# EAGLE design ControllerRC2 (EAGLE 9.2.2)
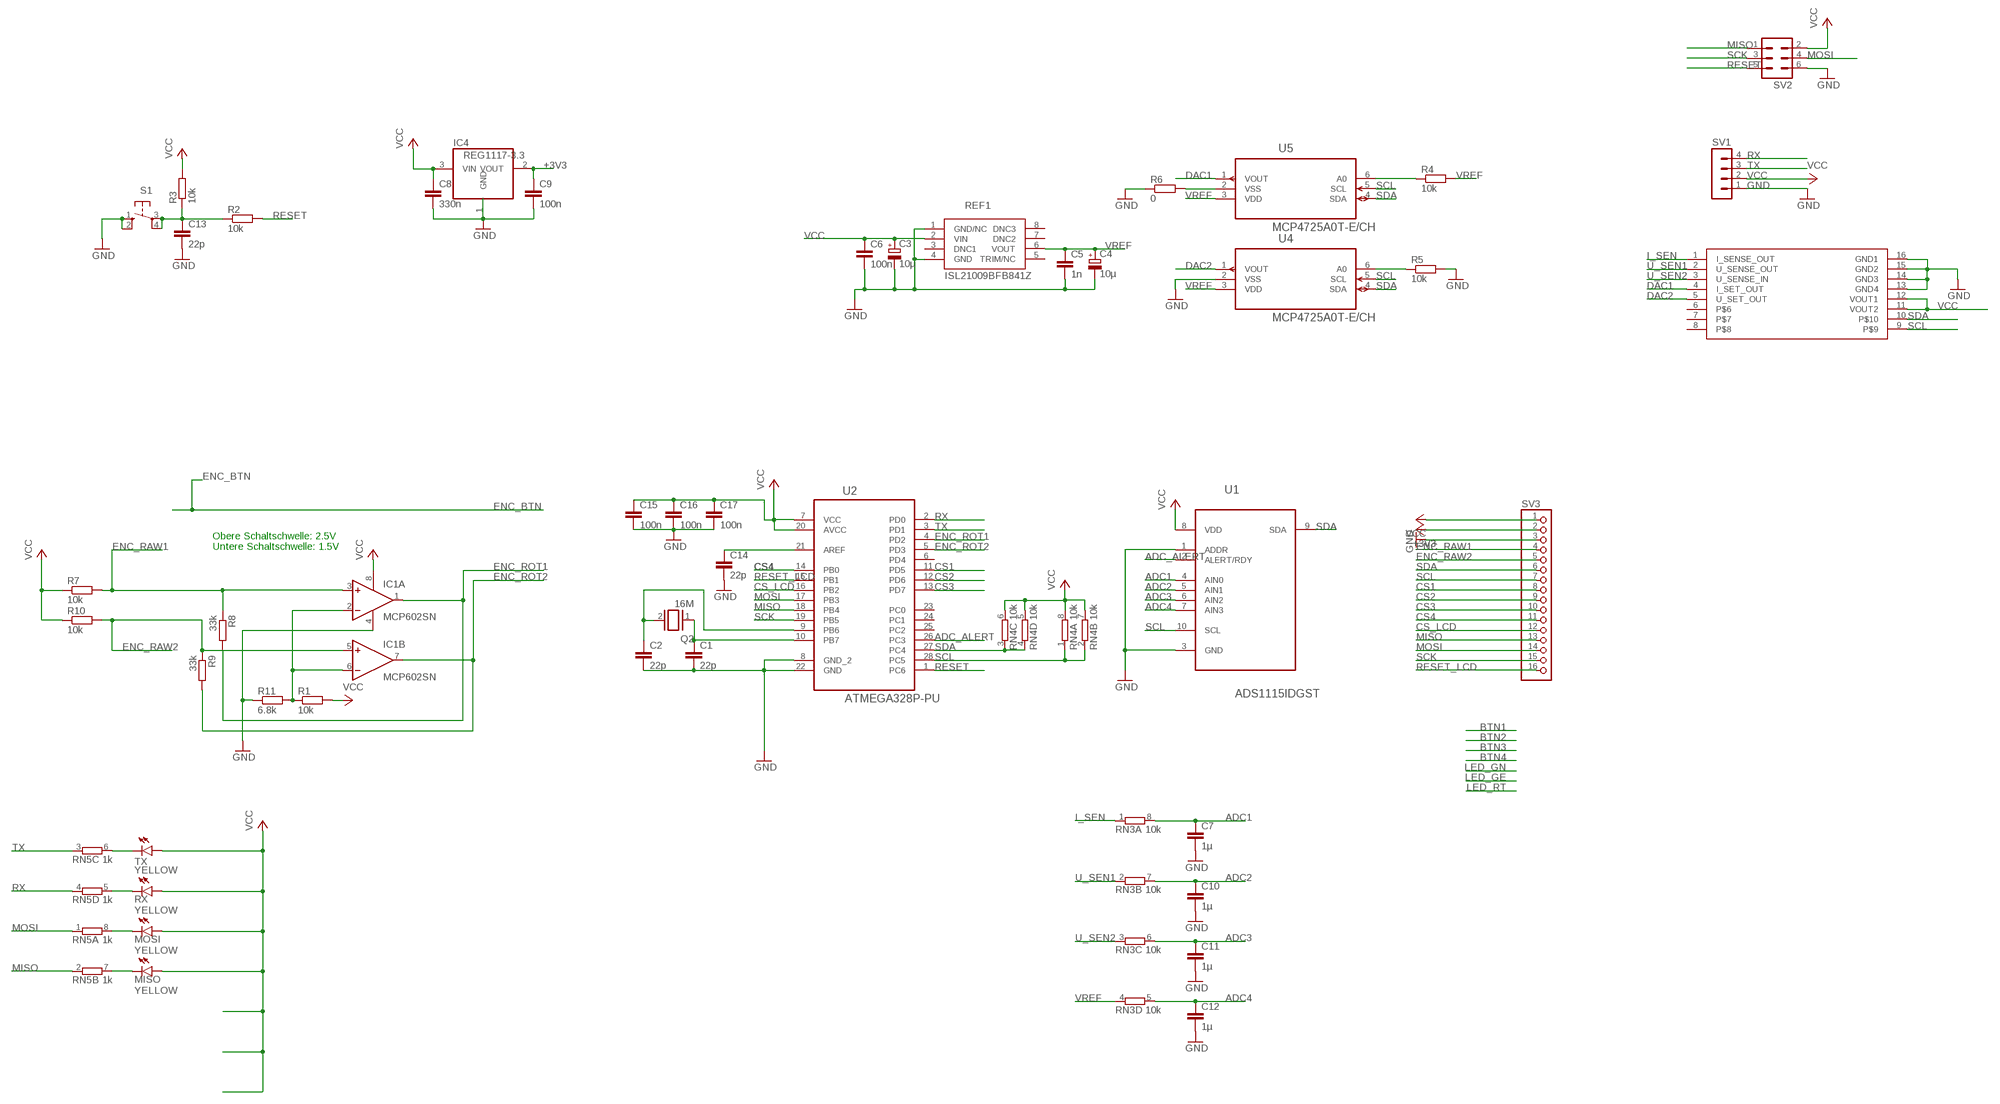
[diagram p0: schematic, sheet 1]

## Parts
C1  22p  C-EUC0603  [C0603]
C2  22p  C-EUC0603  [C0603]
C3  10µ  CPOL-EUE2,5-6E  [E2,5-6E]
C4  10µ  CPOL-EUE2,5-6E  [E2,5-6E]
C5  1n  C-EUC0603  [C0603]
C6  100n  C-EUC0603  [C0603]
C7  1µ  C-EUC0603  [C0603]
C8  330n  C-EUC0603  [C0603]
C9  100n  C-EUC0603  [C0603]
C10  1µ  C-EUC0603  [C0603]
C11  1µ  C-EUC0603  [C0603]
C12  1µ  C-EUC0603  [C0603]
C13  22p  C-EUC0603  [C0603]
C14  22p  C-EUC0603  [C0603]
C15  100n  C-EUC0603  [C0603]
C16  100n  C-EUC0603  [C0603]
C17  100n  C-EUC0603  [C0603]
IC1  MCP602SN  [SO08]
IC4  REG1117-3.3  REG1117  [SOT223]
MISO  YELLOW  LEDCHIP-LED0805  [CHIP-LED0805]
MOSI  YELLOW  LEDCHIP-LED0805  [CHIP-LED0805]
Q2  16M  XTAL/S  [QS]
R1  10k  R-EU_R0603  [R0603]
R2  10k  R-EU_R0603  [R0603]
R3  10k  R-EU_R0603  [R0603]
R4  10k  R-EU_R0603  [R0603]
R5  10k  R-EU_R0603  [R0603]
R6  0  R-EU_R0603  [R0603]
R7  10k  R-EU_R0603  [R0603]
R8  33k  R-EU_R0603  [R0603]
R9  33k  R-EU_R0603  [R0603]
R10  10k  R-EU_R0603  [R0603]
R11  6.8k  R-EU_R0603  [R0603]
REF1  ISL21009BFB841Z  [SOIC127P600X175-8N]
RN3  10k  4R-N0603-ARC  [0603-ARC]
RN4  10k  4R-N0603-ARC  [0603-ARC]
RN5  1k  4R-N0603-ARC  [0603-ARC]
RX  YELLOW  LEDCHIP-LED0805  [CHIP-LED0805]
S1  10-XX  [B3F-10XX]
SV1  MA04-1  [MA04-1]
SV2  MA03-2  [MA03-2]
SV3  PINHD-1X16  [1X16]
TX  YELLOW  LEDCHIP-LED0805  [CHIP-LED0805]
U1  ADS1115IDGST  [SOP50P490X110-10N]
U2  ATMEGA328P-PU  [DIP254P762X457-28]
U4  MCP4725A0T-E/CH  [SOT95P270X145-6N]
U5  MCP4725A0T-E/CH  [SOT95P270X145-6N]
U$1  DCPINHEADER  [CDIP16]

## Nets
+3V3: C9.1 IC4.2(VOUT) SV3.2
ADC1: C7.1 RN3.8 U1.4(AIN0)
ADC2: C10.1 RN3.7 U1.5(AIN1)
ADC3: C11.1 RN3.6 U1.6(AIN2)
ADC4: C12.1 RN3.5 U1.7(AIN3)
ADC_ALERT: U1.2(ALERT/RDY) U2.26(PC3)
CS1: SV3.8 U2.11(PD5)
CS2: SV3.9 U2.12(PD6)
CS3: SV3.10 U2.13(PD7)
CS4: SV3.11 U2.14(PB0)
CS_LCD: SV3.12 U2.16(PB2)
DAC1: U5.1(VOUT) U$1.4(I_SET_OUT)
DAC2: U4.1(VOUT) U$1.5(U_SET_OUT)
ENC_RAW1: IC1.3(A:+IN) R7.2 R8.1 SV3.4
ENC_RAW2: IC1.5(B:+IN) R9.1 R10.2 SV3.5
ENC_ROT1: IC1.1(A:OUT) R8.2 U2.4(PD2)
ENC_ROT2: IC1.7(B:OUT) R9.2 U2.5(PD3)
GND: C1.2 C2.2 C3.- C4.- C5.2 C6.2 C7.2 C8.2 C9.2 C10.2 C11.2 C12.2 C13.2 C14.2 C15.2 C16.2 C17.2 IC1.4(P:V-) IC4.1(GND) R5.2 R6.1 R11.1 REF1.1(GND/NC) REF1.4(GND) S1.1(S) S1.2(S1) SV1.1 SV2.6 SV3.3 U1.1(ADDR) U1.3(GND) U2.8(GND_2) U2.22(GND) U4.2(VSS) U$1.13(GND4) U$1.14(GND3) U$1.15(GND2) U$1.16(GND1)
I_SEN: RN3.1 U$1.1(I_SENSE_OUT)
MISO: RN5.2 SV2.1 SV3.13 U2.18(PB4)
MOSI: RN5.1 SV2.4 SV3.14 U2.17(PB3)
N$1: C1.1 Q2.1 U2.10(PB7)
N$2: RN5.6 TX.C
N$3: RN5.5 RX.C
N$4: MOSI.C RN5.8
N$5: MISO.C RN5.7
N$6: C2.1 Q2.2 U2.9(PB6)
N$7: C14.1 U2.21(AREF)
N$8: R4.1 U5.6(A0)
N$11: R5.1 U4.6(A0)
N$12: R6.2 U5.2(VSS)
N$13: IC1.2(A:-IN) IC1.6(B:-IN) R1.1 R11.2
N$14: C13.1 R2.1 R3.1 S1.3(P) S1.4(P1)
RESET: R2.2 SV2.5 U2.1(PC6)
RESET_LCD: SV3.16 U2.15(PB1)
RX: RN5.4 SV1.4 U2.2(PD0)
SCK: SV2.3 SV3.15 U2.19(PB5)
SCL: RN4.1 RN4.2 SV3.7 U1.10(SCL) U2.28(PC5) U4.5(SCL) U5.5(SCL) U$1.9
SDA: RN4.3 RN4.4 SV3.6 U1.9(SDA) U2.27(PC4) U4.4(SDA) U5.4(SDA) U$1.10
TX: RN5.3 SV1.3 U2.3(PD1)
U_SEN1: RN3.2 U$1.2(U_SENSE_OUT)
U_SEN2: RN3.3 U$1.3(U_SENSE_IN)
VCC: C3.+ C6.1 C8.1 C15.1 C16.1 C17.1 IC1.8(P:V+) IC4.3(VIN) MISO.A MOSI.A R1.2 R3.2 R7.1 R10.1 REF1.2(VIN) RN4.5 RN4.6 RN4.7 RN4.8 RX.A SV1.2 SV2.2 SV3.1 TX.A U1.8(VDD) U2.7(VCC) U2.20(AVCC) U$1.11(VOUT2) U$1.12(VOUT1)
VREF: C4.+ C5.1 R4.2 REF1.6(VOUT) RN3.4 U4.3(VDD) U5.3(VDD)
Unconnected: REF1.3(DNC1) REF1.5(TRIM/NC) REF1.7(DNC2) REF1.8(DNC3) U2.6(PD4) U2.23(PC0) U2.24(PC1) U2.25(PC2) U$1.6 U$1.7 U$1.8

## Notes on the sheet
- Obere Schaltschwelle: 2.5V
  Untere Schaltschwelle: 1.5V

## Library data of the parts
C1 C2 C5-C17 = rcl:C-EU: CAPACITOR, European symbol; SPICEPREFIX: C
C3 C4 = rcl:CPOL-EU: POLARIZED CAPACITOR, European symbol; SPICEPREFIX: C
IC1 = linear:MCP602: Single Op Amp 2.7V to 6.0V Single Supply CMOS Source: http://ww1.microchip.com/downloads/en/DeviceDoc/21314g.pdf
IC4 = burr-brown:REG1117: 800mA and 1A Low Dropout (LDO) Positive Regulator 1.8V, 2.5V, 2.85V, 3.3V, 5V, and Adj; MPN: REG1117; OC_FARNELL: 1097566; OC_NEWARK: 14P6981
MISO MOSI RX TX = led:LED: LED OSRAM: - CHIPLED LG R971, LG N971, LY N971, LG Q971, LY Q971, LO R971, LY R971 LH N974, LH R974 LS Q976, LO Q976, LY Q976 LO Q996 - Hyper CHIPLED LW Q18S LB Q993, LB Q99A, LB R99A - SideLED LS A670, LO A670, LY A670, LG A670, LP A670 LB A673, LV A673, LT A673, LW A673 LH A674 LY A675 LS A676, LA A676, LO A676, LY A676, LW A676 LS A679, LY A679, LG A679 - Hyper Micro SIDELED® LS Y876, LA Y876, LO Y876, LY Y876 LT Y87S - SmartLED LW L88C, LW L88S LB L89C, LB L89S, LG L890 LS L89K, LO L89K, LY L89K LS L896, LA L896, LO L896, LY L896 - TOPLED LS T670, LO T670, LY T670, LG T670, LP T670 LSG T670, LSP T670, LSY T670, LOP T670, LYG T670 LG T671, LOG T671, LSG T671 LB T673, LV T673, LT T673, LW T673 LH T674 LS T676, LA T676, LO T676, LY T676, LB T676, LH T676, LSB T676, LW T676 LB T67C, LV T67C, LT T67C, LS T67K, LO T67K, LY T67K, LW E67C LS E67B, LA E67B, LO E67B, LY E67B, LB E67C, LV E67C, LT E67C LW T67C LS T679, LY T679, LG T679 LS T770, LO T770, LY T770, LG T770, LP T770 LB T773, LV T773, LT T773, LW T773 LH T774 LS E675, LA E675, LY E675, LS T675 LS T776, LA T776, LO T776, LY T776, LB T776 LHGB T686 LT T68C, LB T68C - Hyper Mini TOPLED® LB M676 - Mini TOPLED Santana® LG M470 LS M47K, LO M47K, LY M47K Source: http://www.osram.convergy.de LUXEON: - LUMILED® LXK2-PW12-R00, LXK2-PW12-S00, LXK2-PW14-U00, LXK2-PW14-V00 LXK2-PM12-R00, LXK2-PM12-S00, LXK2-PM14-U00 LXK2-PE12-Q00, LXK2-PE12-R00, LXK2-PE12-S00, LXK2-PE14-T00, LXK2-PE14-U00 LXK2-PB12-K00, LXK2-PB12-L00, LXK2-PB12-M00, LXK2-PB14-N00, LXK2-PB14-P00, LXK2-PB14-Q00 LXK2-PR12-L00, LXK2-PR12-M00, LXK2-PR14-Q00, LXK2-PR14-R00 LXK2-PD12-Q00, LXK2-PD12-R00, LXK2-PD12-S00 LXK2-PH12-R00, LXK2-PH12-S00 LXK2-PL12-P00, LXK2-PL12-Q00, LXK2-PL12-R00 Source: www.luxeon.com KINGBRIGHT: KA-3528ASYC Source: www.kingbright.com
Q2 = special:XTAL/S: CRYSTAL
R1-R11 = rcl:R-EU_: RESISTOR, European symbol; SPICEPREFIX: R
REF1 = custom:ISL21009BFB841Z
RN3-RN5 = resistor-dil:4R-N: Array Chip Resistor Source: RS Component / Phycomp; OC_FARNELL: unknown; OC_NEWARK: unknown
S1 = switch-omron:10-XX: OMRON SWITCH; MPN: B3F-1000; OC_FARNELL: 176432; OC_NEWARK: 36M3542
SV1 = con-lstb:MA04-1: PIN HEADER; OC_FARNELL: unknown; OC_NEWARK: unknown
SV2 = con-lstb:MA03-2: PIN HEADER; OC_FARNELL: unknown; OC_NEWARK: unknown
SV3 = pinhead:PINHD-1X16: PIN HEADER
U1 = Texas Instruments_By_element14_Batch_1:ADS1115IDGST: Analog-to-Digital Converter with Internal Reference; MPN: ADS1115IDGST; OC_FARNELL: 1762981; OC_NEWARK: 25R1241; PACKAGE: MSOP-10; SUPPLIER: Texas Instruments
U2 = Atmel_By_element14_Batch_1-00:ATMEGA328P-PU: 8-bit Microcontroller with In-System Programmable Flash; MPN: ATMEGA328P-PU; OC_FARNELL: 1715487; OC_NEWARK: 15R0268; PACKAGE: PDIP-28; SUPPLIER: Atmel
U4 U5 = Microchip_By_element14_Batch_1:MCP4725A0T-E/CH: 12-Bit Digital-to-Analog Converter with EEPROM; MPN: MCP4725A0T-E/CH; OC_FARNELL: 1578449; OC_NEWARK: 77M3032; PACKAGE: SOT-23-6; SUPPLIER: Microchip
U$1 = custom:DCPINHEADER

## Board
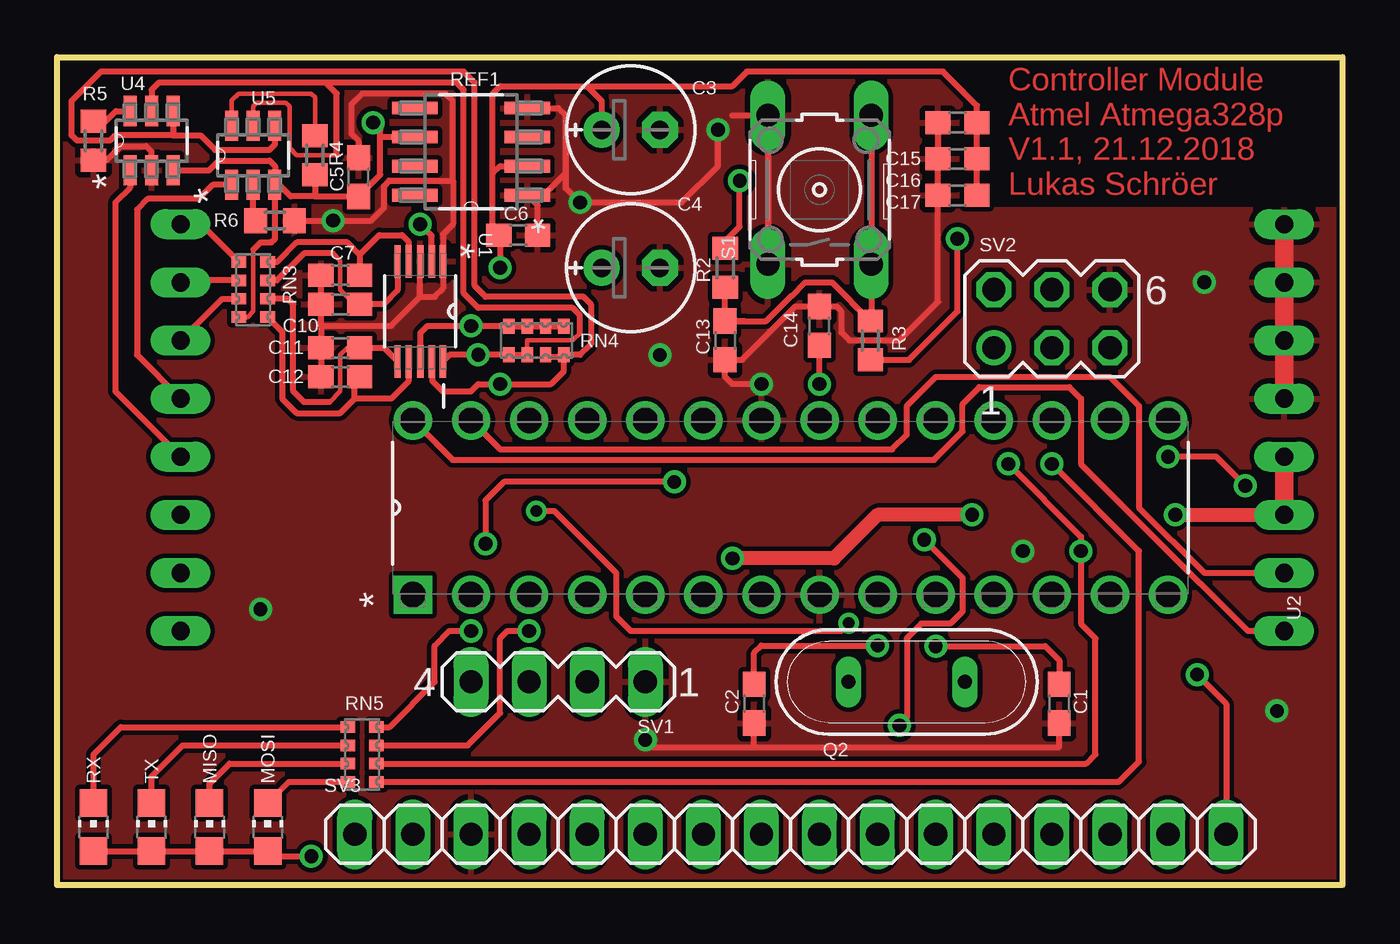
[diagram p1: board, top side]
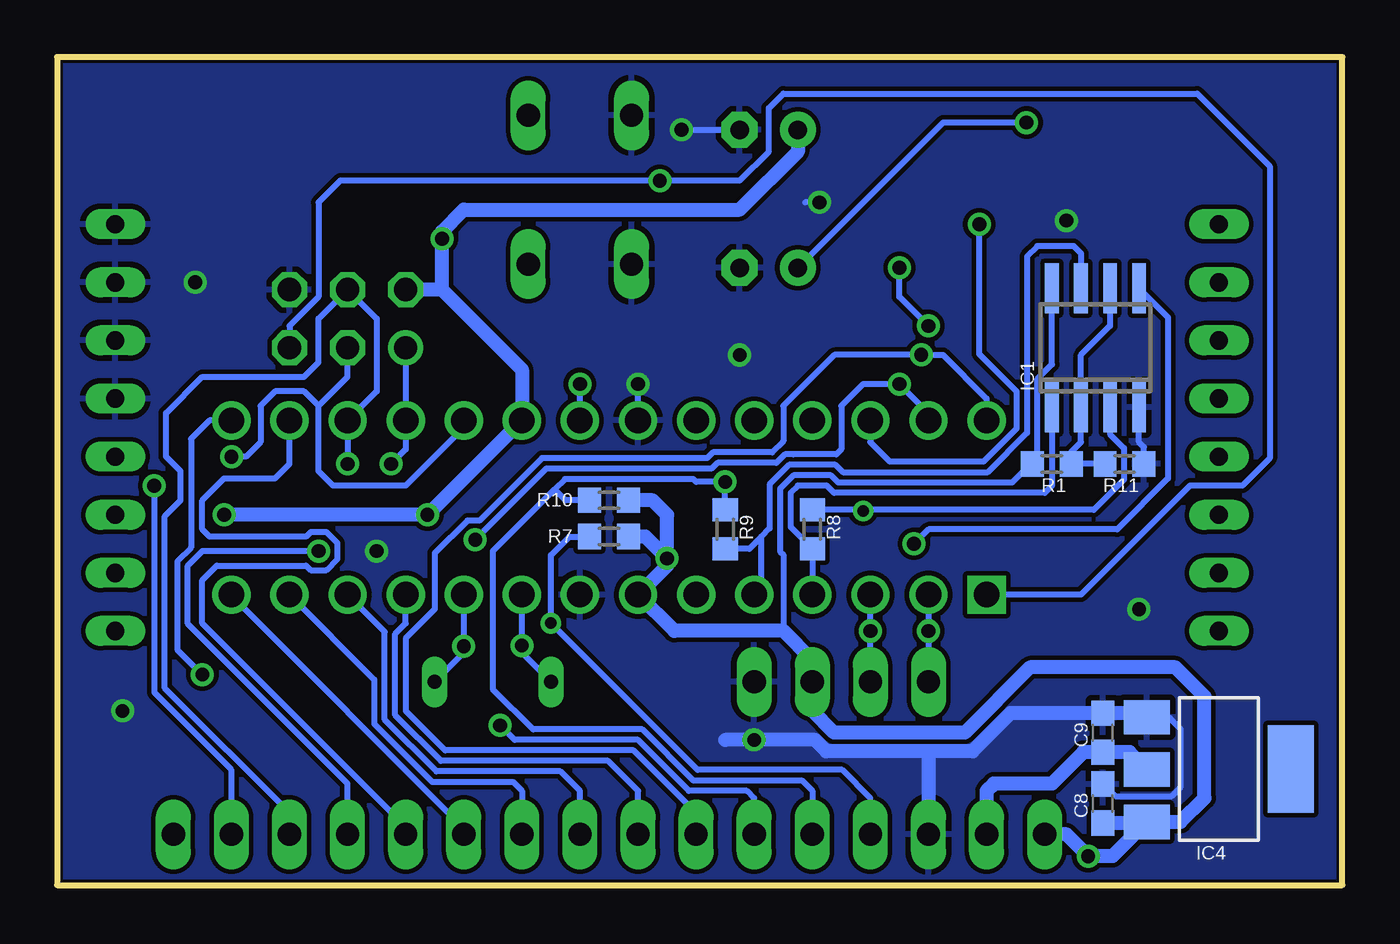
[diagram p2: board, bottom side, seen from below]

Size 56.2 x 36.19 mm. Coordinates in mm from the lower left corner, seen from the top.
Outline: 0,0 56.18,0
Outline: 56.18,36.19 0,36.19 0,0
Outline: 0,0 56.2,0 56.2,36.19 0,36.19 0,0
Copper layers (1*16): Top 0.035mm / dielectric 1.5mm / Bottom 0.035mm
Design rules "default *": minimum track width 7mil, minimum drill 0.5mm, track to track 8mil, track to pad 8mil, pad to pad 8mil, via to via 8mil, smd to smd 8mil, copper to edge 5mil, drill to drill 8mil, minimum pad ring 10mil, minimum via ring 8mil, stop-mask expansion 4mil, vias tented up to drill 0mil, thermal gap 10mil

### Footprints (pad centres in the part's own frame; a part is rotated, then mirrored left to right if it is on the bottom)
C0603 = smd 1.1 x 1: 1 -0.85,0; 2 0.85,0
E2,5-6E = drill 0.813 pad 1.575: + -1.27,0 | drill 0.813 pad 1.575 octagon: - 1.27,0
SO08 = smd 0.6 x 2.2: 1 -1.905,-2.6; 2 -0.635,-2.6; 3 0.635,-2.6; 4 1.905,-2.6; 5 1.905,2.6; 6 0.635,2.6; 7 -0.635,2.6; 8 -1.905,2.6
SOT223 = smd 1.499 x 2.007: 1 -2.261,-3.15; 2 0.025,-3.15; 3 2.311,-3.15 | smd 3.81 x 2.007: 4 0,3.15
CHIP-LED0805 = smd 1.2 x 1.2: A 0,-1.05; C 0,1.05
QS = drill 0.61 long: 1 -2.54,0; 2 2.54,0
R0603 = smd 1 x 1.1: 1 -0.85,0; 2 0.85,0
SOIC127P600X175-8N = smd 1.981 x 0.559: 1 -2.464,1.905; 2 -2.464,0.635; 3 -2.464,-0.635; 4 -2.464,-1.905; 5 2.464,-1.905; 6 2.464,-0.635; 7 2.464,0.635; 8 2.464,1.905
0603-ARC = smd 0.5 x 0.65: 1 -1.2,-0.625; 2 -0.4,-0.625; 3 0.4,-0.625; 4 1.2,-0.625; 5 1.2,0.625; 6 0.4,0.625; 7 -0.4,0.625; 8 -1.2,0.625
B3F-10XX = drill 1.016 long: 1 -3.251,2.261; 2 3.251,2.261; 3 -3.251,-2.261; 4 3.251,-2.261
MA04-1 = drill 1.016 long: 1 -3.81,0; 2 -1.27,0; 3 1.27,0; 4 3.81,0
MA03-2 = drill 1.016: 1 -2.54,-1.27 | drill 1.016 octagon: 2 -2.54,1.27; 3 0,-1.27; 4 0,1.27; 5 2.54,-1.27; 6 2.54,1.27
1X16 = drill 1.016 long: 1 -19.05,0; 2 -16.51,0; 3 -13.97,0; 4 -11.43,0; 5 -8.89,0; 6 -6.35,0; 7 -3.81,0; 8 -1.27,0; 9 1.27,0; 10 3.81,0; 11 6.35,0; 12 8.89,0; 13 11.43,0; 14 13.97,0; 15 16.51,0; 16 19.05,0
SOP50P490X110-10N = smd 1.422 x 0.279: 1 -2.184,0.991; 2 -2.184,0.508; 3 -2.184,0; 4 -2.184,-0.508; 5 -2.184,-0.991; 6 2.184,-0.991; 7 2.184,-0.508; 8 2.184,0; 9 2.184,0.508; 10 2.184,0.991
DIP254P762X457-28 = drill 1.118 square: 1 -7.62,33.02 | drill 1.118: 2 -7.62,30.48; 3 -7.62,27.94; 4 -7.62,25.4; 5 -7.62,22.86; 6 -7.62,20.32; 7 -7.62,17.78; 8 -7.62,15.24; 9 -7.62,12.7; 10 -7.62,10.16; 11 -7.62,7.62; 12 -7.62,5.08; 13 -7.62,2.54; 14 -7.62,0; 15 0,0; 16 0,2.54; 17 0,5.08; 18 0,7.62; 19 0,10.16; 20 0,12.7; 21 0,15.24; 22 0,17.78; 23 0,20.32; 24 0,22.86; 25 0,25.4; 26 0,27.94; 27 0,30.48; 28 0,33.02
SOT95P270X145-6N = smd 1.321 x 0.559: 1 -1.295,0.94; 2 -1.295,0; 3 -1.295,-0.94; 4 1.295,-0.94; 5 1.295,0; 6 1.295,0.94
CDIP16 = drill 0.8 long: 1 -25.4,7.62; 2 -25.4,5.08; 3 -25.4,2.54; 4 -25.4,0; 5 -25.4,-2.54; 6 -25.4,-5.08; 7 -25.4,-7.62; 8 -25.4,-10.16; 9 22.86,-10.16; 10 22.86,-7.62; 11 22.86,-5.08; 12 22.86,-2.54; 13 22.86,0; 14 22.86,2.54; 15 22.86,5.08; 16 22.86,7.62

### Placement (x,y rotation side)
C1  43.82,7.94 270 top
C2  30.48,7.94 270 top
C3  25.08,33.02 0 top
C4  25.08,26.99 0 top
C5  13.18,30.96 90 top
C6  20.16,28.42 0 top
C7  12.38,26.67 180 top
C8  10.48,3.57 90 bottom
C9  10.48,6.67 90 bottom
C10  12.38,25.4 180 top
C11  12.38,23.49 180 top
C12  12.38,22.22 180 top
C13  29.21,23.81 270 top
C14  33.34,24.45 90 top
C15  39.37,33.34 180 top
C16  39.37,31.75 180 top
C17  39.37,30.16 180 top
IC1  10.8,23.49 0 bottom
IC4  5.4,5.08 270 bottom
MISO  6.67,2.54 0 top
MOSI  9.21,2.54 0 top
Q2  37.15,8.89 180 top
R1  12.7,18.41 180 bottom
R2  29.21,26.99 90 top
R3  35.56,23.81 270 top
R4  11.27,31.91 270 top
R5  1.59,32.54 270 top
R6  9.52,29.05 180 top
R7  32.07,15.24 180 bottom
R8  23.18,15.56 270 bottom
R9  26.99,15.56 270 bottom
R10  32.07,16.83 180 bottom
R11  9.52,18.41 180 bottom
REF1  18.1,32.07 180 top
RN3  8.57,26.03 270 top
RN4  20.95,23.81 0 top
RN5  13.34,5.71 90 top
RX  1.59,2.54 0 top
S1  33.34,30.4 90 top
SV1  21.91,8.89 180 top
SV2  43.5,24.77 0 top
SV3  32.07,2.22 0 top
TX  4.13,2.54 0 top
U1  15.88,25.08 270 top
U2  48.58,20.32 90 top
U4  4.13,32.54 90 top
U5  8.57,31.91 90 top
U$1  30.8,21.27 0 top

### Tracks (layer width: path | path; a pad name or v marks a point on that pad's centre or on a via)
+3V3
  Bottom 0.61: IC4.2 9.31,5.82 C9.1 11.33,5.82 12.7,4.45 15.24,4.45 15.56,4.13 SV3.2
ADC1
  Top 0.254: 13.23,27.57 12.7,28.1 10.48,28.1 9.61,27.23 RN3.8 | 13.23,27.57 C7.1 | 13.23,27.57 14.08,28.42 15.08,28.42 15.37,28.13 U1.4
ADC2
  Top 0.191: 13.02,25.4 12.38,26.03 12.38,27.3 12.06,27.62
  Top 0.254: 13.02,25.4 C10.1 14.29,25.4 14.88,26 U1.5 | 12.06,27.62 10.8,27.62 9.61,26.44 RN3.7
ADC3
  Top 0.191: 11.91,21.11 12.38,21.59 12.38,23.18 12.7,23.49 C11.1
  Top 0.254: 11.91,21.11 10.8,21.11 10.32,21.59 10.32,25.4 10.08,25.63 RN3.6 | C11.1 14.29,23.49 U1.6
ADC4
  Top 0.254: 13.02,21.27 13.02,22.22 C12.1 | 13.02,21.27 12.38,20.64 10.48,20.64 9.84,21.27 9.84,24.19 RN3.5 | U1.7 15.37,22.03 14.6,21.27 13.02,21.27
ADC_ALERT  (via drill 0.6)
  Top 0.254: U1.2 16.38,28.38 v15.88,28.89
  Bottom 0.254: U2.26 20.64,19.37 19.79,18.52 15.69,18.52 14.24,19.96 14.24,21.59 15.88,23.22 v15.88,28.89
CS1
  Bottom 0.254: U2.11 40.96,11.44 41.41,10.98 41.41,7.43 39.42,5.44 32.11,5.44 30.8,4.13 SV3.8
CS2
  Bottom 0.254: U2.12 41.87,11.07 41.87,7.24 39.61,4.98 34.19,4.98 33.34,4.13 SV3.9
CS3
  Bottom 0.254: U2.13 42.33,8.99 42.33,7.05 39.8,4.52 36.27,4.52 35.88,4.13 SV3.10
CS4
  Bottom 0.254: SV3.11 38.42,2.49 48.58,12.65 U2.14
CS_LCD
  Bottom 0.254: U2.16 46.04,18.41 46.67,17.78 48.9,17.78 49.85,16.83 49.85,15.56 49.53,15.24 45.31,15.24 45.11,15.44 44.42,15.44 43.93,14.95 43.93,14.26 44.42,13.77 45.11,13.77 45.31,13.97 49.21,13.97 49.85,13.33 49.85,11.44 40.96,2.55 SV3.12 40.96,2.54
DAC1
  Top 0.254: U5.1 6.8,30.61 6.19,30 3.97,30 3.49,29.53 3.49,23.18 U$1.4
DAC2
  Top 0.254: U4.1 3.19,30.49 2.54,29.84 2.54,21.59 U$1.5
ENC_RAW1  (via drill 0.5)
  Top 0.254: v20.95,16.36 21.74,16.36 24.45,13.65 24.45,11.75 25.08,11.11 34.29,11.11 34.29,11.14 v34.61,11.45
  Bottom 0.254: SV3.4 20.64,3.81 21.87,5.04 28.2,5.04 v34.61,11.45 34.61,14.43 33.79,15.24 R7.2 | IC1.3 10.16,19.72 9.54,19.1 9.54,17.73 10.87,16.41 20.95,16.41 | 20.95,16.41 R8.1 | 20.95,16.41 v20.95,16.36
ENC_RAW2  (via drill 0.6)
  Top 0.254: v18.73,14.92 18.73,16.83 19.54,17.63 v26.99,17.63
  Bottom 0.254: SV3.5 23.18,4.13 23.63,4.58 28.39,4.58 30.61,6.81 35.38,6.81 37.15,8.57 37.15,14.6 34.45,17.3 | IC1.5 7.62,24.83 7.62,17.78 9.84,15.56 18.1,15.56 v18.73,14.92 | R9.1 v26.99,17.63 28.26,17.63 28.38,17.75 34,17.75 34.45,17.3 | R10.2 33.97,16.83 34.45,17.3
ENC_ROT1
  Bottom 0.254: U2.4 R8.2 24.13,15.66 24.13,17.14 23.81,17.46 22.54,17.46 22.23,17.14 13.02,17.14 12.7,17.46 IC1.1
ENC_ROT2
  Bottom 0.254: R9.2 25.93,14.71 25.4,15.24 | U2.5 25.4,13.02 25.4,15.24 | 25.4,15.24 25.04,15.6 25.04,17.52 24.19,18.38 22.16,18.38 21.85,18.06 15.5,18.06 13.79,19.77 13.79,27.49 13.34,27.94 11.75,27.94 11.43,27.62 IC1.7
GND  (via drill 0.6)
  Top 0.254: C12.2 C11.2 11.53,24.45 | 15.88,25.72 14.6,24.45 11.53,24.45 | 15.88,25.72 U1.3 | 15.88,25.72 16.51,25.72 16.87,26.07 U1.1 16.87,28.45 17.3,28.89 17.3,30.8 | U4.2 4.13,32.07 3.89,32.31 2.78,32.31 2.17,31.69 R5.2 | 11.53,24.45 C10.2 C7.2 | 17.3,30.8 17.3,34.29 16.99,34.61 13.34,34.61 12.86,34.13 12.86,32.86 13.18,32.54 C5.2 | R6.1 v12.06,29.05 13.73,29.05 14.29,29.61 14.29,30.56 14.53,30.8 17.3,30.8 | C6.2 21.01,29.71 REF1.1 21.27,30.16 22.23,31.11 | REF1.4 21.91,33.97 22.23,33.66 22.23,31.11 | C15.2 C16.2 C17.2 38.52,25.5 36.83,23.81 34.64,23.81 34.29,24.16 34.29,25.08 34.07,25.3 C14.2 32.28,25.3 29.95,22.96 C13.2 29.21,22.22 29.53,21.91 v30.8,21.91 | 22.23,31.11 22.23,30.48 v22.86,29.84 27.3,29.84 28.89,31.43 v28.89,33.02 | S1.1 S1.2 29.52,33.65 | 30.48,6.03 C2.2 | 30.48,6.03 43.82,6.03 C1.2 | v25.72,6.35 26.03,6.03 30.48,6.03
  Top 0.61: 53.44,28.68 U$1.16
  Top 0.813: U$1.16 U$1.15 U$1.14 U$1.13
  Bottom 0.254: C8.2 10.45,4.42 9.92,3.89 7.46,3.89 7.06,4.29 7.06,6.83 7.54,7.3 8.51,7.3 IC4.1 | v22.86,29.84 23.49,29.84 | v28.89,33.02 C3.- | U2.22 v30.8,21.91 | R11.1 8.67,19.15 8.89,19.37 IC1.4
  Bottom 0.61: 8.55,7.59 IC4.1 8.72,7.52 C9.2 14.51,7.52 16.17,5.85 18.1,5.85 | 26.99,6.35 v25.72,6.35 23.06,6.35 22.56,5.85 18.1,5.85 | 18.1,5.85 SV3.3
  other vias: 8.89,12.06 53.34,7.62 50.16,26.35 26.35,23.18 42.23,14.6
  pour Bottom: 0,36.19 56.2,36.19 56.2,0 0,0
  pour Top: 0,36.19 40.96,36.19 40.96,29.53 56.2,29.53 56.2,0 0,0
I_SEN
  Top 0.254: U$1.1 6.29,28.89 RN3.1
MISO  (via drill 0.6)
  Top 0.254: v41.59,18.41 44.77,15.24 v44.77,14.6 44.77,11.43 45.4,10.79 45.4,5.71 45,5.31 RN5.2
  Bottom 0.254: SV2.1 U2.18 40.96,19.05 v41.59,18.41 | v44.77,14.6 49.85,14.6 50.48,13.97 50.48,11.43 43.5,4.45 SV3.13
MOSI  (via drill 0.6)
  Top 0.254: v43.5,18.41 47.31,14.6 47.31,5.4 46.43,4.52 RN5.1
  Bottom 0.254: v43.5,18.41 U2.17 42.23,21.59 42.23,24.77 SV2.4 44.77,24.77 44.77,22.86 45.4,22.22 49.85,22.22 51.43,20.64 51.43,18.73 50.8,18.1 50.8,16.83 51.49,16.13 51.49,8.62 46.04,3.16 SV3.14
N$1  (via drill 0.6)
  Top 0.254: C1.1 43.82,9.84 43.21,10.45 v38.42,10.45
  Bottom 0.254: U2.10 v38.42,10.45 38.42,10.16 Q2.1
N$2
  Top 0.254: TX.C 4.13,4.76 5.48,6.11 RN5.6
N$3
  Top 0.254: RX.C 1.59,5.71 2.79,6.91 RN5.5
N$4
  Top 0.254: 9.3,3.49 MOSI.C 10.13,4.52 RN5.8
N$5
  Top 0.254: MISO.C 6.67,4.45 7.54,5.31 RN5.7
N$6  (via drill 0.6)
  Top 0.254: C2.1 30.58,8.89 30.48,8.99 30.48,10.16 30.8,10.48 v35.88,10.48
  Bottom 0.254: Q2.2 35.88,10.16 v35.88,10.48 U2.9
N$7  (via drill 0.6)
  Top 0.254: v33.34,21.91 C14.1
  Bottom 0.254: U2.21 v33.34,21.91
N$8
  Top 0.191: R4.1 11.27,34.45 11.11,34.61 7.94,34.61 7.63,34.3 U5.6
  Top 0.254: U5.6 7.62,33.22
N$11
  Top 0.254: U4.6 3.16,33.87 | R5.1 2.12,33.39 2.56,33.84 U4.6 | 3.16,33.81 U4.6
N$12
  Top 0.254: 8.57,30.16 U5.2 8.57,29.15 R6.2
N$13
  Bottom 0.254: IC1.6 10.16,24.45 11.43,23.18 IC1.2 11.43,19.37 11.85,18.95 R1.1 R11.2
N$14
  Top 0.254: S1.4 S1.3 35.6,24.7 R3.1 | 30.06,24.66 C13.1 | R3.1 35.34,24.66 | C13.1 R2.1 | C13.1 31,24.66 32.09,25.75 32.1,25.75 32.7,26.35 33.87,26.35 R3.1
RESET  (via drill 0.6)
  Top 0.254: v29.84,30.8 29.84,28.79 29.21,28.16 R2.2
  Bottom 0.254: U2.1 11.43,12.7 6.67,17.46 4.37,17.46 3.17,18.66 3.17,31.43 6.35,34.61 24.45,34.61 25.08,33.97 25.08,32.07 26.35,30.8 v29.84,30.8 43.82,30.8 44.77,29.84 44.77,25.72 46.04,24.45 SV2.5
RESET_LCD  (via drill 0.6)
  Top 0.254: v49.85,9.21 51.12,7.94 SV3.16
  Bottom 0.254: U2.15 49.53,20.32 50.34,19.51 50.34,14.76 50.94,14.16 50.94,10.3 v49.85,9.21
RX  (via drill 0.6)
  Top 0.254: RN5.4 14.53,6.91 16.51,8.89 16.51,10.48 17.14,11.11 v18.1,11.11
  Bottom 0.254: U2.2 v18.1,11.11 SV1.4
SCK  (via drill 0.6)
  Top 0.254: v51.95,17.46 50.68,18.73 v48.58,18.73
  Bottom 0.254: U2.19 38.42,20 40.96,17.46 44.13,17.46 44.77,18.1 44.77,20.95 | 44.77,20.95 43.5,22.22 SV2.3 | 44.77,20.95 45.4,21.59 46.67,21.59 47.31,20.95 47.31,19.37 47.94,18.73 v48.58,18.73 | v51.95,17.46 51.95,8.43 48.59,5.07 48.59,2.23 SV3.15
SCL  (via drill 0.6)
  Top 0.191: U5.5 8.57,34.05 8.73,34.21 10,34.21 10.16,34.05 10.16,32.23 10.48,31.91 12.22,31.91 | RN4.2 20.55,23.81 22.54,23.81 22.86,24.13
  Top 0.254: U4.5 4.13,34.77 4.45,35.08 11.75,35.08 | RN4.2 RN4.1 v18.41,23.19 17.16,23.19 U1.10 | 22.86,24.13 22.86,24.92 22.54,25.24 18.41,25.24 17.78,25.88 17.78,34.77 17.46,35.08 11.75,35.08 | 12.22,31.91 12.22,34.61 11.75,35.08 | U2.28 17.28,18.59 38.34,18.59 39.59,19.84 39.59,21.03 40.32,21.77 44.27,21.77 44.77,21.27 44.77,18.4 49.98,13.2 49.99,13.2 52.07,11.11 U$1.9
  Bottom 0.254: U2.28 15.56,21.27 17.46,23.18 18.41,23.18 v18.41,23.19 22.21,23.19 24.45,20.95 24.45,19.41 24.94,18.92 27.52,18.92 27.77,18.67 35,18.67 37.73,15.94 38.26,15.94 39.69,14.51 39.69,12.06 40.96,10.79 40.96,7.62 39.23,5.89 30.99,5.89 28.26,3.16 SV3.7
SDA  (via drill 0.6)
  Top 0.254: U5.4 9.52,32.38 9.29,32.15 6.91,32.15 6.27,32.78 5.07,32.78 | 5.07,32.78 2.54,32.78 2.3,32.54 0.87,32.54 0.63,32.78 0.63,34.29 1.9,35.56 17.78,35.56 18.26,35.08 18.26,26.19 18.73,25.72 23.02,25.72 23.34,25.4 23.34,23.65 22.87,23.19 RN4.4 | RN4.4 22.08,23.11 21.43,23.11 RN4.3 21.27,23.27 | U4.4 5.07,32.78 | U1.9 16.4,22.88 16.4,22.05 16.86,21.59 18.1,21.59 18.41,21.91 v19.37,21.91 21.59,21.91 22.16,22.47 RN4.4 | v36.83,6.98 37.15,7.3 37.15,10.79 37.78,11.43 39.05,11.43 39.59,11.96 39.59,13.44 v37.92,15.11 | U2.27 19.37,19.05 36.51,19.05 37.15,19.69 37.15,20.95 38.42,22.22 46.04,22.22 47.31,20.95 47.31,16.51 50.16,13.65 U$1.10
  Bottom 0.254: U2.27 18.1,20.64 v19.37,21.91 20.95,21.91 21.91,20.95 21.91,19.05 22.12,18.83 24,18.83 | 24,18.83 | 24,18.83 24.38,18.83 24.75,18.46 27.33,18.46 27.59,18.21 34.81,18.21 37.6,15.42 v37.92,15.11 | v36.83,6.98 36.2,6.35 30.8,6.35 28.57,4.13 26.03,4.13 25.72,3.81 SV3.6
TX  (via drill 0.6)
  Top 0.254: v20.64,11.11 19.68,11.11 19.37,10.79 19.37,7.54 17.95,6.11 RN5.3
  Bottom 0.254: SV1.3 v20.64,11.11 U2.3
U_SEN1
  Top 0.254: RN3.2 5.48,26.44 arc90 U$1.2
U_SEN2
  Top 0.254: U$1.3 7.22,25.63 RN3.3
VCC  (via drill 0.6)
  Top 0.254: U1.8 15.88,24.13 16.19,24.45 v18.1,24.45 RN4.8 RN4.7 RN4.6 | RN4.5 RN4.6 | RN4.6 | 19.05,31.11 19.05,28.68 C6.1 19.37,28.36 v19.37,26.99 | 19.05,31.11 19.37,31.43 REF1.2 | 19.05,31.11 19.05,34.61 19.37,34.92 23.18,34.92 | 23.18,34.92 23.81,34.29 C3.+ | C17.1 C16.1 C15.1 40.22,34.08 38.73,35.56 30.16,35.56 29.53,34.92 23.18,34.92 | RX.A TX.A MISO.A MOSI.A 9.43,1.27 v11.11,1.27 | R3.2 37.25,22.96 39.37,25.08 v39.37,28.26
  Top 0.61: v40,16.19 35.88,16.19 33.97,14.29 v29.53,14.29 | v48.9,16.19 U$1.11
  Top 0.813: U$1.11 U$1.12
  Bottom 0.254: v18.1,24.45 19.37,25.72 v19.37,26.99 | 24.45,11.11 24.45,14.45 24.59,14.59 24.59,17.33 24,17.92 22.35,17.92 22.04,17.6 14.44,17.6 13.63,18.41 | IC1.8 12.7,22.76 13.33,22.13 13.33,18.73 | 13.33,18.71 13.33,18.73 | R1.2 13.55,18.51 13.33,18.73
  Bottom 0.61: C8.1 8.59,2.72 IC4.3 | 39.37,26.03 35.88,22.54 U2.20 v40,16.19 v48.9,16.19 | 39.37,26.03 SV2.2 | C3.+ 23.81,32.07 26.35,29.53 38.42,29.53 39.37,28.58 v39.37,28.26 39.37,26.03 | v29.53,14.29 29.53,13.97 U2.7 29.21,11.11 24.45,11.11 23.18,9.84 SV1.2 23.18,7.62 22.23,6.67 16.51,6.67 13.65,9.52 7.3,9.52 6.03,8.25 6.03,3.81 7.07,2.77 IC4.3 | IC4.3 10.05,1.27 v11.11,1.27 12.06,2.22 SV3.1 | v29.53,14.29 30.48,15.24 R7.1 | v29.53,14.29 29.53,16.19 30.16,16.83 R10.1 | R1.2 13.63,18.41
VREF  (via drill 0.6)
  Top 0.191: RN3.4 8.32,24.83 8.57,25.08 8.57,27.78
  Top 0.254: U4.3 6.64,31.25 7.06,31.67 9.29,31.67 9.52,31.43 9.52,30.63 U5.3 | U5.3 9.71,30.61 10.22,30.11 11.27,30.11 | 14.76,32.7 REF1.6 14.13,32.7 | U5.3 9.52,28.26 9.37,28.1 8.89,28.1 8.57,27.78 | 14.13,32.7 14.13,33.02 v13.81,33.34 | 11.27,30.11 C5.1 14.13,31.06 14.13,32.7 | R4.2 11.27,30.11
  Bottom 0.254: v13.81,33.34 17.46,33.34 C4.+

### Text on the board
Top: Controller Module / Atmel Atmega328p / V1.1, 21.12.2018 / Lukas Schröer
tStop: Controller Module / Atmel Atmega328p / V1.1, 21.12.2018 / Lukas Schröer